# EAGLE schematic Encoder_Links (EAGLE 7.2.0)
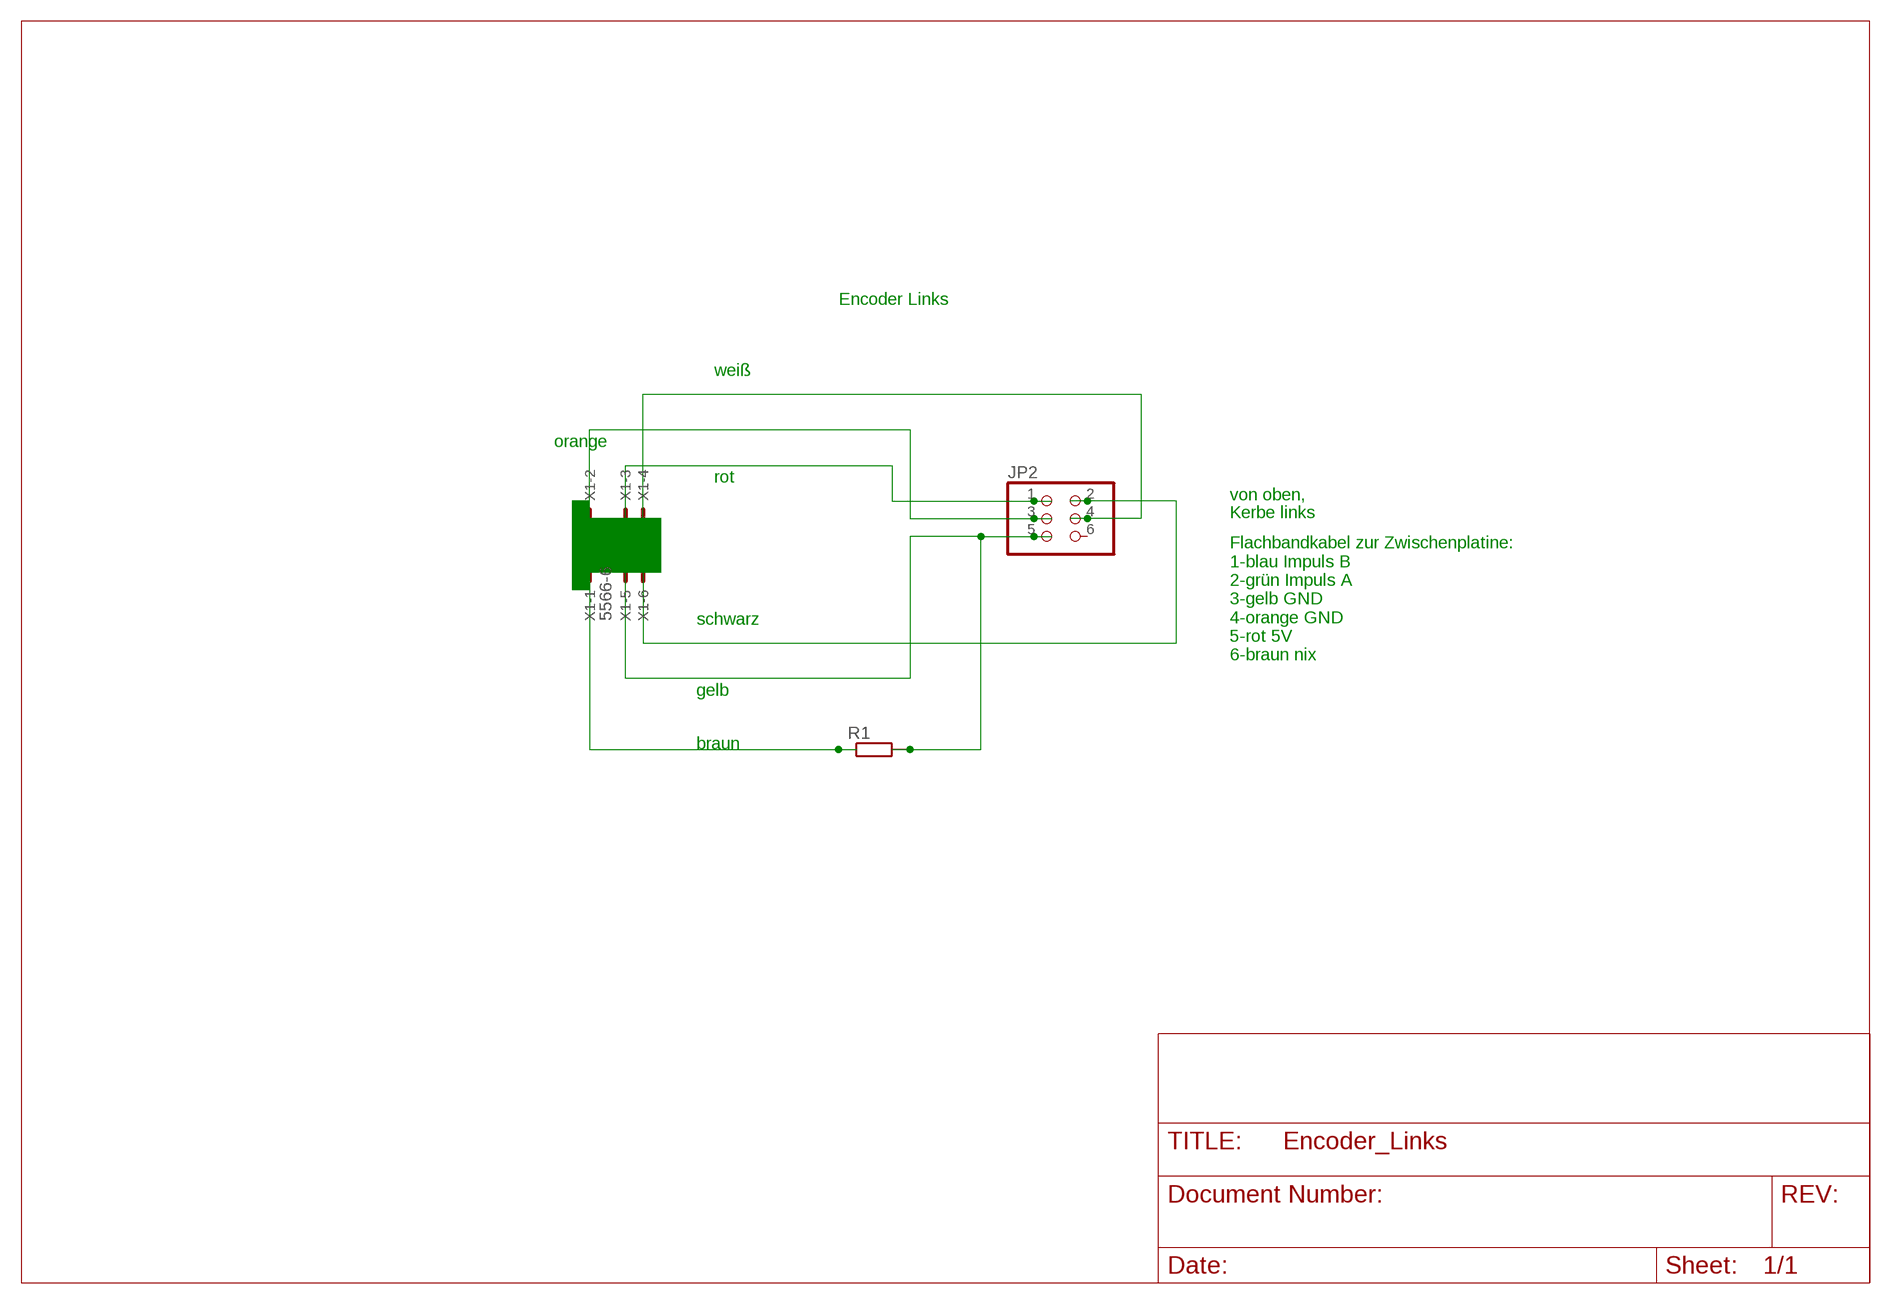
[diagram p0: schematic, sheet 1]

## Parts
JP2  PINHD-2X3/90  [2X03/90]
R1  R-EU_0207/10  [0207/10]
X1  5566-6  [5566-6]

## Nets
N$1: JP2.3
N$2: JP2.1
N$3: JP2.4
N$4: R1.1
N$5: JP2.5 R1.2
N$6: JP2.2
Unconnected: JP2.6 X1.1 X1.2 X1.3 X1.4 X1.5 X1.6

## Notes on the sheet
- Encoder Links
- weiß
- orange
- rot
- von oben,
- Kerbe links
- schwarz
- Flachbandkabel zur Zwischenplatine:
  1-blau Impuls B
  2-grün Impuls A
  3-gelb GND
  4-orange GND
  5-rot 5V
  6-braun nix
- gelb
- braun

## Library data of the parts
JP2 = pinhead:PINHD-2X3: PIN HEADER
R1 = rcl:R-EU_: RESISTOR, European symbol
X1 = con-molex:5566-6: Mini FIT connector 6 pol Source: http://www.molex.com; MPN: 95566-61002; OC_FARNELL: unknown; OC_NEWARK: 22K8620